# EAGLE design MagSwitchRev1_2 (EAGLE 7.6.0)
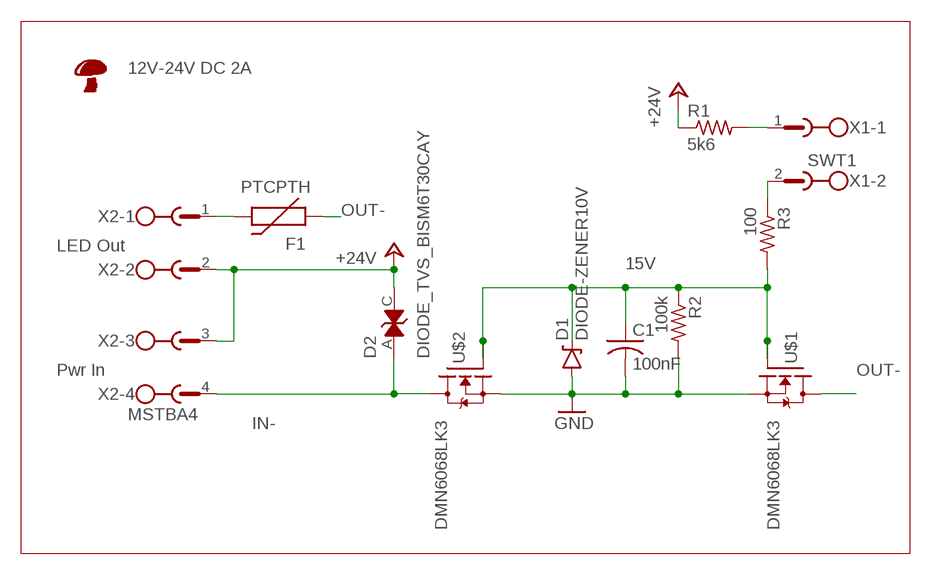
[diagram p0: schematic, sheet 1]

## Parts
C1  100nF  C-USC0805  [C0805]
D1  DIODE-ZENER10V  DIODE-ZENER15V  [SOD-323]
D2  DIODE_TVS_BISM6T30CAY  [SMB-DIODE]
F1  PTCPTH  [PTC]
R1  5k6  R-US_M0805  [M0805]
R2  100k  R-US_M0805  [M0805]
R3  100  R-US_M0805  [M0805]
U$1  DMN6068LK3  [TO252]
U$2  DMN6068LK3  [TO252]
U$4  SHROOM5MM  [SHROOM]
X1  SWT1  MSTBA2  [MSTBA2]
X2  MSTBA4  [MSTBA4]

## Nets
15V: C1.1 D1.C R2.1 R3.2 U$1.1(G) U$2.1(G)
+24V: D2.C R1.1 X2.2 X2.3
GND: C1.2 D1.A R2.2 U$1.2(S) U$2.2(S)
IN-: D2.A U$2.3(D) X2.4
N$1: F1.P$2 X2.1
N$2: R1.2 X1.1
N$3: R3.1 X1.2
OUT-: F1.P$1 U$1.3(D)

## Notes on the sheet
- 12V-24V DC 2A
- LED Out
- Pwr In

## Library data of the parts
C1 = resistor:C-US: CAPACITOR, American symbol
D1 = RobThePyro:DIODE-ZENER: ON Semiconductor MM3Z15VST1G Zener Diode, 15V 300 mW SMT 2-Pin SOD-323 RS stock no.802-4568ManufacturerON Semiconductor Mfr. Part No.MM3Z15VST1G
D2 = RobThePyro:DIODE_TVS_BI: STMicroelectronics SM6T30CAY Bi-Directional TVS Diode, 600W peak, 2-Pin DO-214AA RS stock no. 795-8877 Brand STMicroelectronics Mfr. Part No. SM6T30CAY
F1 = SparkFun-PowerIC:PTC: Resettable Fuse PTC Resettable Fuse. Spark Fun Electronics SKU : COM-08357
R1-R3 = resistor:R-US_: RESISTOR, American symbol
U$1 U$2 = RobThePyro:DMN6068LK3
U$4 = RobThePyro:SHROOM
X1 = con-phoenix-508:MSTBA2: PHOENIX; MF: FARNELL; MPN: 1757242; OC_FARNELL: 3705171; OC_NEWARK: 71C4161
X2 = con-phoenix-508:MSTBA4: PHOENIX; MF: FARNELL; MPN: 1757268; OC_FARNELL: 3705195; OC_NEWARK: 71C4163

## Board
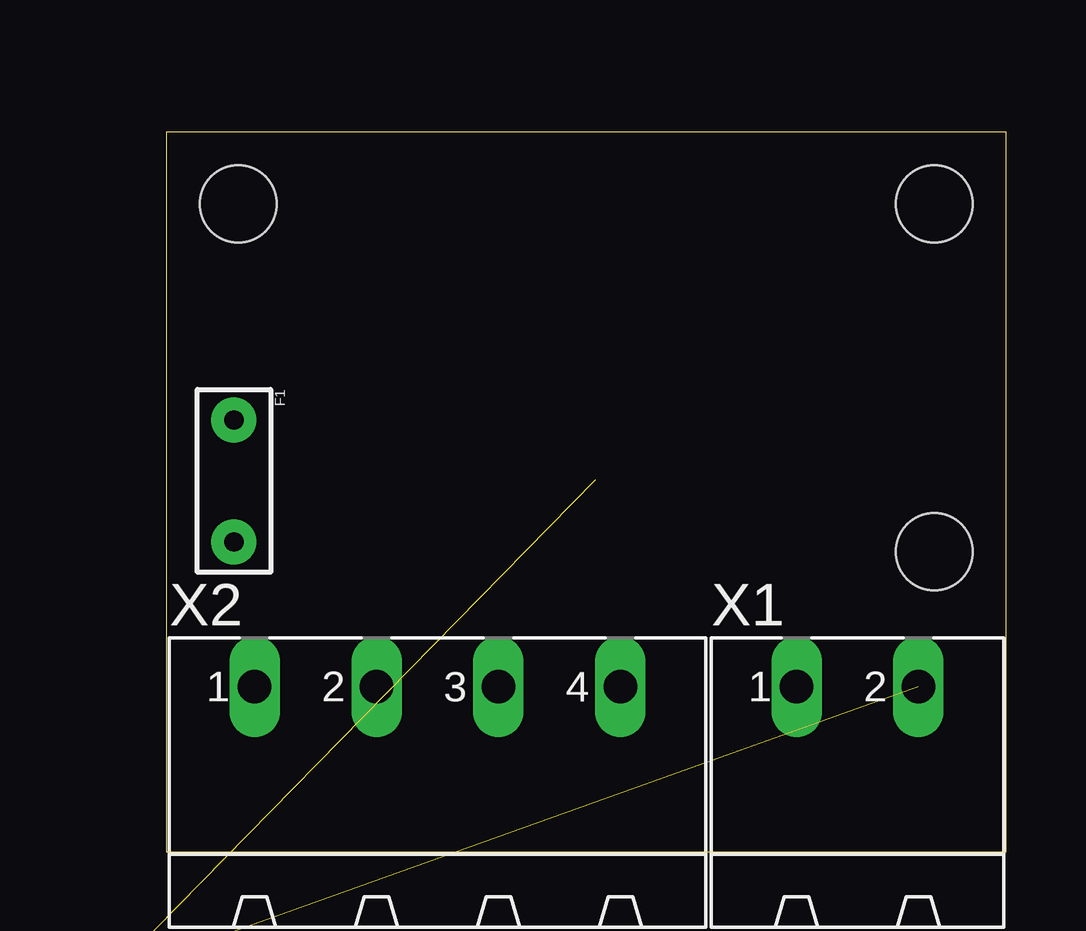
[diagram p1: board, top side]
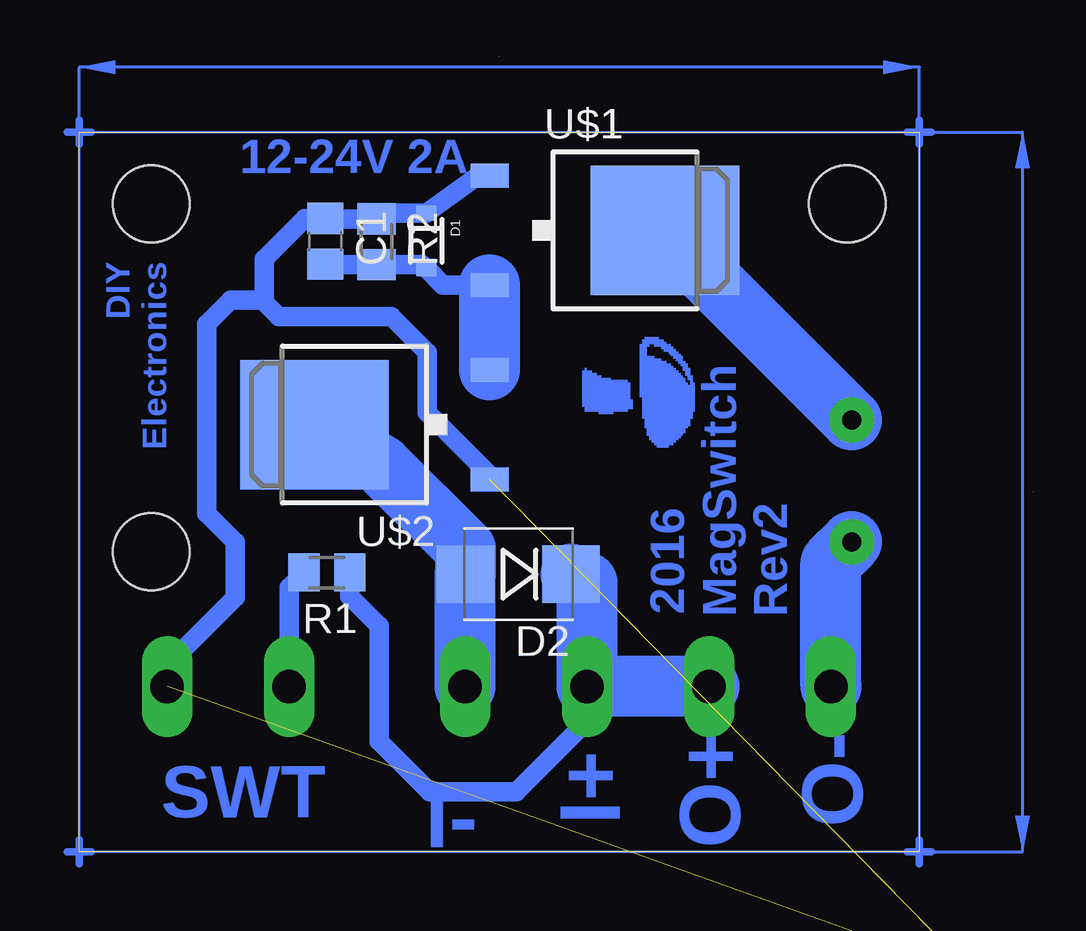
[diagram p2: board, bottom side, seen from below]

Size 35 x 30 mm. Coordinates in mm from the lower left corner, seen from the top.
Outline: 0,0 35,0 35,30 0,30 0,0
Copper layers (1*16): Top 0.035mm / dielectric 1.5mm / Bottom 0.035mm
Design rules "default": minimum track width 10mil, minimum drill 24mil, track to track 8mil, track to pad 8mil, pad to pad 8mil, via to via 8mil, smd to smd 8mil, copper to edge 40mil, drill to drill 8mil, minimum pad ring 10mil, minimum via ring 8mil, stop-mask expansion 4mil, vias tented up to drill 0mil, thermal gap 10mil
Holes 3.2 mm at 3,27 32,27 32,12.5

### Footprints (pad centres in the part's own frame; a part is rotated, then mirrored left to right if it is on the bottom)
C0805 = smd 1.3 x 1.5: 1 -0.95,0; 2 0.95,0
SOD-323 = smd 0.63 x 0.83: A 1.15,0; C -1.15,0
SMB-DIODE = smd 2.4 x 2.4: A 2.2,0; C -2.2,0
PTC = drill 0.8 pad 1.88: P$1 -2.54,0; P$2 2.54,0
M0805 = smd 1.3 x 1.6: 1 -0.95,0; 2 0.95,0
TO252 = smd 1 x 1.6: 1 -2.28,-4.8; 2 2.28,-4.8 | smd 5.4 x 6.2: 3 0,2.5
MSTBA2 = drill 1.397 long: 1 -2.54,5.08; 2 2.54,5.08
MSTBA4 = drill 1.397 long: 1 -7.62,5.08; 2 -2.54,5.08; 3 2.54,5.08; 4 7.62,5.08

### Placement (x,y rotation side)
C1  24.75,25.45 270 bottom
D1  20.55,25.46 270 bottom
D2  16.71,11.57 180 bottom
F1  2.82,15.45 270 top
R1  24.69,11.63 180 bottom
R2  22.62,25.42 270 bottom
R3  -4.3,-6.2 0 top  (outside the outline)
U$1  13.1,25.9 270 bottom
U$2  22.7,17.8 90 bottom
U$4  14,21.5 270 bottom
X1  28.8,1.8 0 top
X2  11.3,1.8 0 top

### Tracks (layer width: path | path; a pad name or v marks a point on that pad's centre or on a via)
15V  (1 unrouted)
  Bottom 0.813: 31.34,7.76 28.5,10.6 28.5,12.9 29.7,14.1 29.7,22 28.7,23 27.3,23 | U$1.1 18.38,28.18 D1.C 22.38,26.61 R2.1 24.73,26.37 C1.1 25.61,26.39 27.3,24.7 27.3,23 | U$2.1 17.9,15.7 20.5,18.3 20.5,20.8 22,22.3 26.7,22.3 27.3,22.9 27.3,23
+24V
  Bottom 0.813: X2.3 13.8,6.84 13.8,5.5 16.8,2.5 20.4,2.5 22.5,4.6 22.5,9.4 23.73,10.63 R1.1
  Bottom 2.54: X2.2 X2.3 13.84,11.2 D2.C
GND
  Bottom 0.813: 17.9,23.13 U$1.2 19.85,23.62 D1.A 20.71,24.47 R2.2 24.73,24.47 C1.2
  Bottom 2.54: U$2.2 U$1.2
IN-
  Bottom 2.54: X2.4 18.92,11.55 D2.A 18.91,12.61 22.4,16.1 U$2.3
N$1
  Bottom 2.54: X2.1 3.68,12.05 F1.P$2
N$2
  Bottom 0.813: R1.2 26.26,11.01 X1.1
N$3  (1 unrouted)
N$5
  Bottom 0.1: 0,30 35,30 35,0 0,0 0,30
  Bottom 0.305: 0,29.5 0,30 0,30.5 | 35.5,0 35,0 34.5,0
N$8
  Bottom 0.305: -0.5,30 0.5,30
N$9
  Bottom 0.305: 35,29.5 35,30.5
N$10
  Bottom 0.305: 35.5,30 34.5,30
N$11
  Bottom 0.305: 0,0.5 0,-0.5
N$12
  Bottom 0.305: -0.5,0 0.5,0
N$14
  Bottom 0.305: 35,0.5 35,-0.5
OUT-
  Bottom 2.54: F1.P$1 10.1,25.27 10.1,26.3 10.5,25.9 U$1.3
(copper drawn outside any net)
  shapes: Bottom area x2, Bottom circle x3

### Text on the board
Bottom: 12-24V 2A | DIY / Electronics | MagSwitch / Rev2 | 2016 | O- | O+ | I+ | I- | SWT